# Altium schematic sheet PowerManagement.SchDoc: Set in Document Options » Parameters » Title
size Tabloid; Author: Set in Document Options » Parameters » Author + Contact info
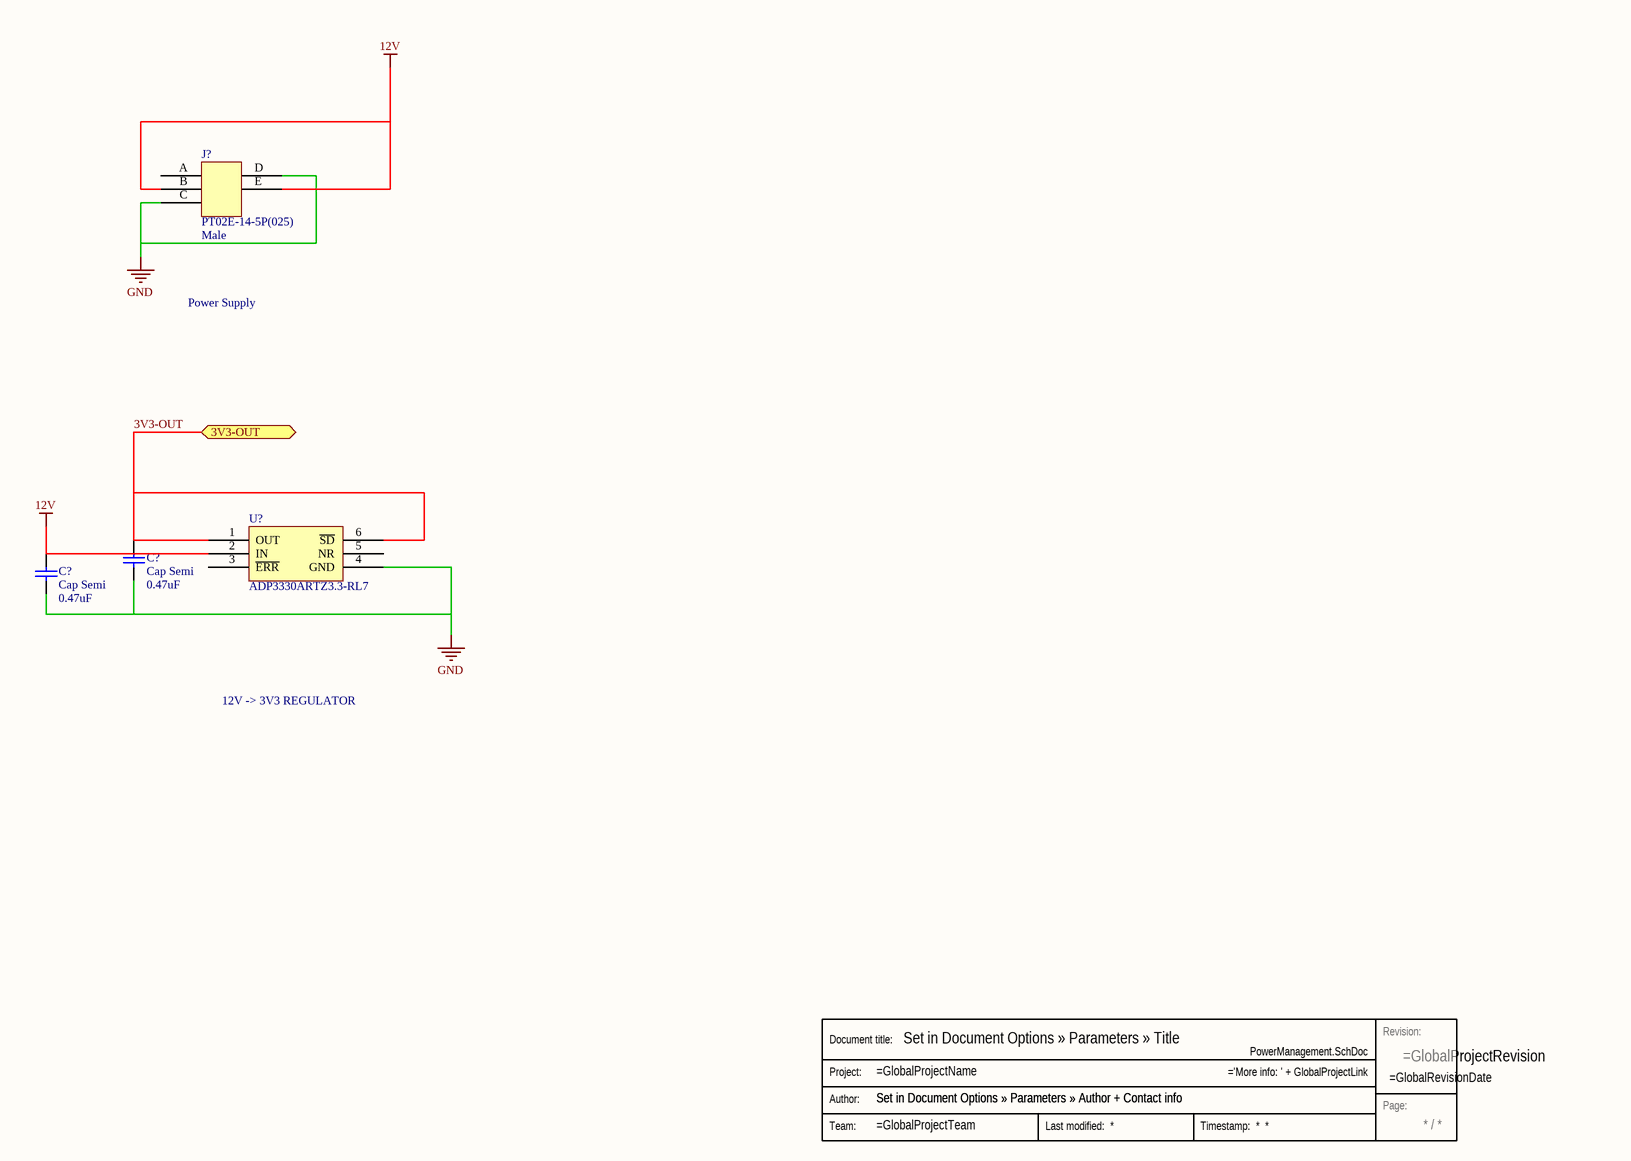
[diagram p0: PowerManagement.SchDoc]

## Parts
(Parts that share a designator on the sheet are numbered #1, #2 ... from top to bottom, then left to right.)
C?#1  Cap Semi  value 0.47uF  [0402]
C?#2  Cap Semi  value 0.47uF  [0402]
J?  Gender: Male  (hidden comment: PT02E-14-5P(025))
Stamp  Stamp  (value not drawn)  (graphical)
U?  ADP3330ARTZ3.3-RL7

## Ports
3V3-OUT

## Nets

Not connected (* = marked no-connect by the designer): C?#1 1 2; C?#2 1 2; J? A B C D E; U? 1(OUT) 2(IN) 3(~{ERR}) 4(GND) 5(NR) 6(~{SD})

## Buses and harness runs
bus 3V3-OUT = port 3V3-OUT

## Notes on the sheet
- Power Supply
- 12V -> 3V3 REGULATOR
- Labels drawn without touching a wire or pin: 12V, GND
- (in symbol Stamp) Revision:; Document title:; Project:; Author:; Page:; Team:

## Library data of the parts
C?#1 C?#2 = Cap Semi: Capacitor (Semiconductor SIM Model); Published: 8-Jun-2000; LatestRevisionDate: 29-May-2009; LatestRevisionNote: IPC-7351 Footprint Added.; PackageReference: C1206; Publisher: Altium Limited; PackageDescription: Chip Capacitor
J? = PT02E-14-5P(025): Manufacturer: Amphenol Industrial Operations; Digikey P/N: PT02E-14-5P(025)-ND; Digikey Link: https://www.digikey.com/product-detail/en/amphenol-industrial-operations/PT02E-14-5P(025)/PT02E-14-5P(025)-ND/1209810; Manufacturer P/N: PT02E-14-5P(025)
U? = ADP3330ARTZ3.3-RL7: Manufacturer: Analog Devices; Digikey P/N: ADP3330ARTZ3.3-RL7DKR-ND; Digikey Link: https://www.digikey.com/product-detail/en/analog-devices-inc/ADP3330ARTZ3.3-RL7/ADP3330ARTZ3.3-RL7DKR-ND/1788602; Manufacturer P/N: ADP3330ARTZ3.3-RL7